# EAGLE schematic MJ818 original (EAGLE 8.3.1)
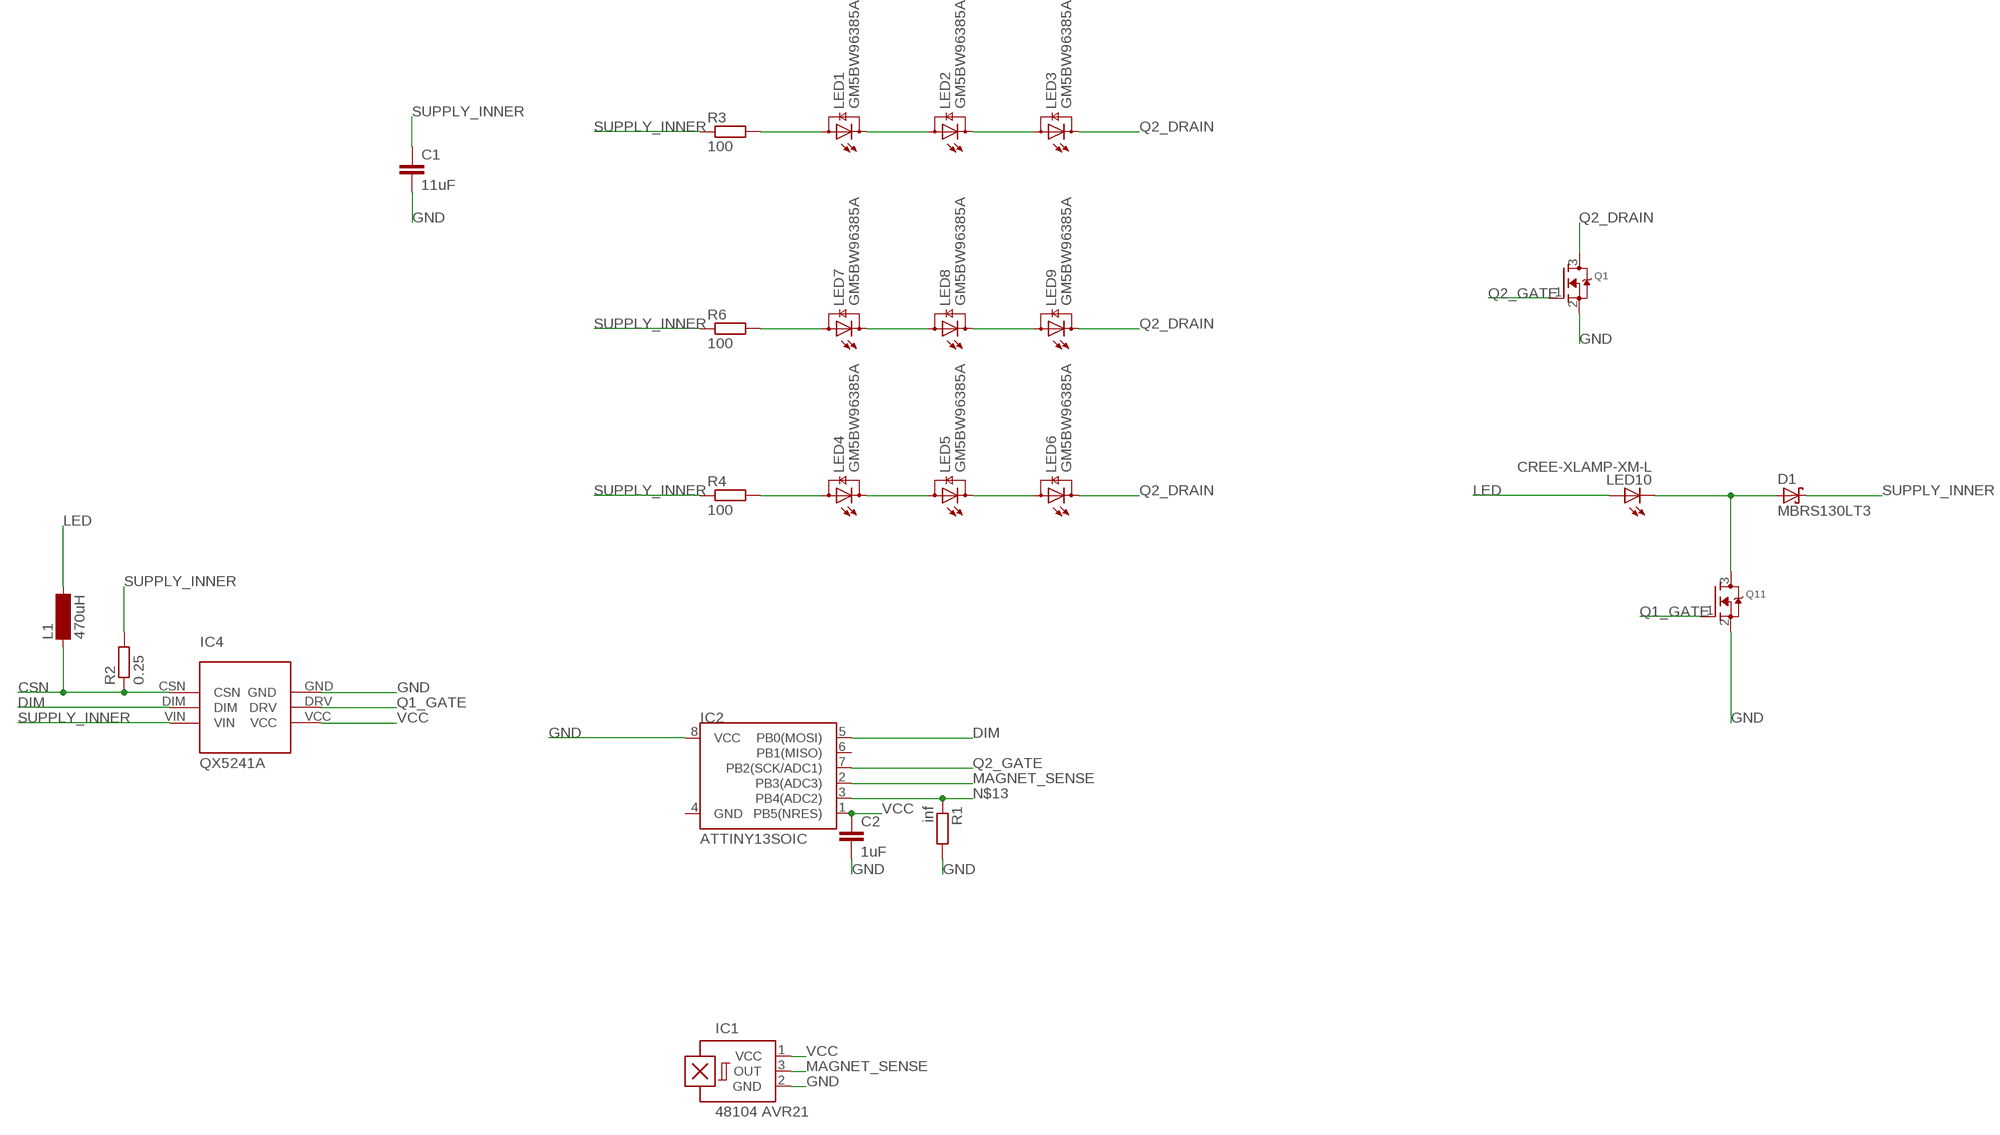
[diagram p0: schematic, sheet 1]

## Parts
C1  11uF  C-EUC3225  [C3225]
C2  1uF  C-EUC2012  [C2012]
D1  MBRS130LT3  [SMB]
IC1  48104 AVR21  A1202UA  [SIP3-UA]
IC2  ATTINY13SOIC  [SO08_MCU]
IC4  QX5241A  [SOT-23-6]
L1  470uH  MS50  [MS50]
LED1  GM5BW96385A  [GM5BW96385A]
LED2  GM5BW96385A  [GM5BW96385A]
LED3  GM5BW96385A  [GM5BW96385A]
LED4  GM5BW96385A  [GM5BW96385A]
LED5  GM5BW96385A  [GM5BW96385A]
LED6  GM5BW96385A  [GM5BW96385A]
LED7  GM5BW96385A  [GM5BW96385A]
LED8  GM5BW96385A  [GM5BW96385A]
LED9  GM5BW96385A  [GM5BW96385A]
LED10  CREE-XLAMP-XM-L  [CREE-XLAMP-XM-L]
Q1  MOSFET-NWAVE  [SOT23-W]
Q11  MOSFET-NWAVE  [SOT23-W]
R1  inf  R-EU_R3216  [R3216]
R2  0.25  R-EU_R3216  [R3216]
R3  100  R-EU_R3216  [R3216]
R4  100  R-EU_R3216  [R3216]
R6  100  R-EU_R3216  [R3216]

## Nets
CSN: IC4.CSN L1.1 R2.1
DIM: IC2.5(PB0(MOSI)) IC4.DIM
GND: C1.2 C2.2 IC1.2(GND) IC2.8(VCC) IC4.GND Q1.2(S) Q11.2(S) R1.2
LED: L1.2 LED10.A LED10.A@1(A)
MAGNET_SENSE: IC1.3(OUT) IC2.2(PB3(ADC3))
N$1: LED1.C LED2.A
N$2: LED2.C LED3.A
N$3: LED7.C LED8.A
N$4: LED8.C LED9.A
N$5: LED1.A R3.2
N$6: LED4.A R4.2
N$7: LED4.C LED5.A
N$8: LED5.C LED6.A
N$9: LED7.A R6.2
N$13: IC2.3(PB4(ADC2)) R1.1
Q1_GATE: IC4.DRV Q11.1(G)
Q2_DRAIN: D1.A LED3.C LED6.C LED9.C LED10.C LED10.C@1(C) Q1.3(D) Q11.3(D)
Q2_GATE: IC2.7(PB2(SCK/ADC1)) Q1.1(G)
SUPPLY_INNER: C1.1 D1.C IC4.VIN R2.2 R3.1 R4.1 R6.1
VCC: C2.1 IC1.1(VCC) IC2.1(PB5(NRES)) IC4.VCC
Unconnected: IC2.4(GND) IC2.6(PB1(MISO))

## Library data of the parts
C1 C2 = rcl:C-EU: CAPACITOR, European symbol
D1 = diode:MBRS130LT3: Schottky Power Rectifier Source: http://www.onsemi.com/pub/Collateral/MBRS130LT3-D.PDF
IC1 = allegro:A12*?: Hall-effect bipolar switch Source: http://www.allegromicro.com/en/Products/Part_Numbers/1202/1202.pdf; OC_FARNELL: unknown; OC_NEWARK: unknown
IC2 = SparkFun-Retired:ATTINY13: ATTINY13 Retired
IC4 = QX5241a - LED Driver:QX5241A
L1 = inductor-neosid:MS50: INDUCTOR SMD power inductor; OC_FARNELL: unknown; OC_NEWARK: unknown
LED1-LED9 = led:GM5BW96385A: High brightness White Color LED 2300 mcd @ IF = 20mA achieved via InGaN Blue LED chip in combination with Yellow Phosphor Source: http://document.sharpsma.com/files/GM5BW96385A.pdf
LED10 = led:CREE-XLAMP-XM-L: Cree® XLamp® XM-L LEDs Source: http://www.cree.com
Q1 Q11 = adafruit:MOSFET-N: N-Channel Mosfet 2N7002E - 60V 260mA SOT23 [Digikey: 2N7002ET1GOSTR-ND] - REEL BSH103 - 30V 850mA SOT23 [Digikey: 568-5013-1-ND]
R1-R4 R6 = rcl:R-EU_: RESISTOR, European symbol